# Altium schematic sheet MICRO.SchDoc
size A4; SheetNumber: 1; SheetTotal: 6
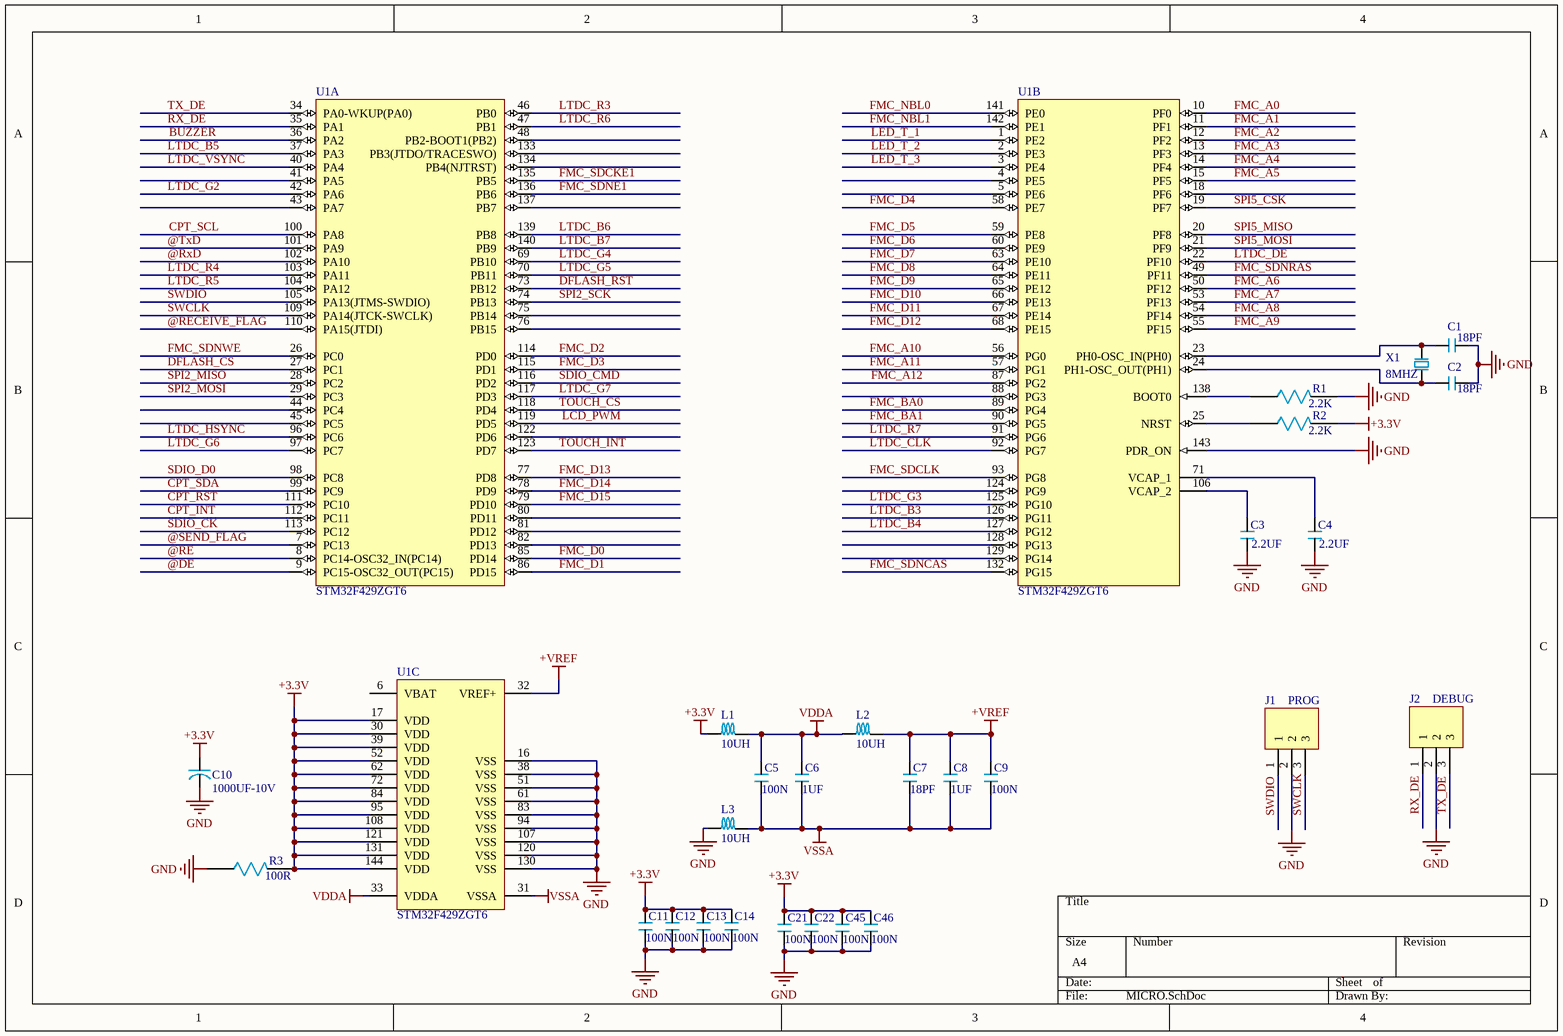
[diagram p0: MICRO.SchDoc]

## Parts
C1  18PF  [0603]
C2  18PF  [0603]
C3  2.2UF  [1206]
C4  2.2UF  [1206]
C5  100N  [0603]
C6  1UF  [0603]
C7  18PF  [0603]
C8  1UF  [0603]
C9  100N  [0603]
C10  1000UF-10V  [RB.2/.4]
C11  100N  [0603]
C12  100N  [0603]
C13  100N  [0603]
C14  100N  [0603]
C21  100N  [0603]
C22  100N  [0603]
C45  100N  [0603]
C46  100N  [0603]
J1  PROG  [SIP3]
J2  DEBUG  [SIP3]
L1  10UH  [1206]
L2  10UH  [1206]
L3  10UH  [1206]
R1  2.2K  [0603]
R2  2.2K  [0603]
R3  100R  [1206]
U1  STM32F429ZGT6  [STM-LQFP144_N]  (parts A,B,C of 3)
X1  8MHZ  [XTAL_1]

## Nets
+3.3V: C10.1 C11.2 C12.2 C13.2 C14.2 C21.2 C22.2 C45.2 C46.2 L1.1 R2.2 R3.2 U1.17(VDD) U1.30(VDD) U1.39(VDD) U1.52(VDD) U1.62(VDD) U1.72(VDD) U1.84(VDD) U1.95(VDD) U1.108(VDD) U1.121(VDD) U1.131(VDD) U1.144(VDD)
+VREF: C7.2 C8.2 C9.2 L2.2 U1.32(VREF+)
GND: C1.2 C2.2 C3.1 C4.1 C10.2 C11.1 C12.1 C13.1 C14.1 C21.1 C22.1 C45.1 C46.1 J1.2 J2.2 L3.1 R1.2 R3.1 U1.16(VSS) U1.38(VSS) U1.51(VSS) U1.61(VSS) U1.83(VSS) U1.94(VSS) U1.107(VSS) U1.120(VSS) U1.130(VSS) U1.143(PDR_ON)
VDDA: C5.2 C6.2 L1.2 L2.1 U1.33(VDDA)
VSSA: C5.1 C6.1 C7.1 C8.1 C9.1 L3.2 U1.31(VSSA)
@DE: U1.9(PC15-OSC32_OUT(PC15))
@RE: U1.8(PC14-OSC32_IN(PC14))
@RECEIVE_FLAG: U1.110(PA15(JTDI))
@RxD: U1.102(PA10)
@SEND_FLAG: U1.7(PC13)
@TxD: U1.101(PA9)
BUZZER: U1.36(PA2)
CPT_INT: U1.112(PC11)
CPT_RST: U1.111(PC10)
CPT_SCL: U1.100(PA8)
CPT_SDA: U1.99(PC9)
DFLASH_CS: U1.27(PC1)
DFLASH_RST: U1.73(PB12)
FMC_A0: U1.10(PF0)
FMC_A1: U1.11(PF1)
FMC_A2: U1.12(PF2)
FMC_A3: U1.13(PF3)
FMC_A4: U1.14(PF4)
FMC_A5: U1.15(PF5)
FMC_A6: U1.50(PF12)
FMC_A7: U1.53(PF13)
FMC_A8: U1.54(PF14)
FMC_A9: U1.55(PF15)
FMC_A10: U1.56(PG0)
FMC_A11: U1.57(PG1)
FMC_A12: U1.87(PG2)
FMC_BA0: U1.89(PG4)
FMC_BA1: U1.90(PG5)
FMC_D0: U1.85(PD14)
FMC_D1: U1.86(PD15)
FMC_D2: U1.114(PD0)
FMC_D3: U1.115(PD1)
FMC_D4: U1.58(PE7)
FMC_D5: U1.59(PE8)
FMC_D6: U1.60(PE9)
FMC_D7: U1.63(PE10)
FMC_D8: U1.64(PE11)
FMC_D9: U1.65(PE12)
FMC_D10: U1.66(PE13)
FMC_D11: U1.67(PE14)
FMC_D12: U1.68(PE15)
FMC_D13: U1.77(PD8)
FMC_D14: U1.78(PD9)
FMC_D15: U1.79(PD10)
FMC_NBL0: U1.141(PE0)
FMC_NBL1: U1.142(PE1)
FMC_SDCKE1: U1.135(PB5)
FMC_SDCLK: U1.93(PG8)
FMC_SDNCAS: U1.132(PG15)
FMC_SDNE1: U1.136(PB6)
FMC_SDNRAS: U1.49(PF11)
FMC_SDNWE: U1.26(PC0)
LCD_PWM: U1.119(PD5)
LED_T_1: U1.1(PE2)
LED_T_2: U1.2(PE3)
LED_T_3: U1.3(PE4)
LTDC_B3: U1.126(PG11)
LTDC_B4: U1.127(PG12)
LTDC_B5: U1.37(PA3)
LTDC_B6: U1.139(PB8)
LTDC_B7: U1.140(PB9)
LTDC_CLK: U1.92(PG7)
LTDC_DE: U1.22(PF10)
LTDC_G2: U1.42(PA6)
LTDC_G3: U1.125(PG10)
LTDC_G4: U1.69(PB10)
LTDC_G5: U1.70(PB11)
LTDC_G6: U1.97(PC7)
LTDC_G7: U1.117(PD3)
LTDC_HSYNC: U1.96(PC6)
LTDC_R3: U1.46(PB0)
LTDC_R4: U1.103(PA11)
LTDC_R5: U1.104(PA12)
LTDC_R6: U1.47(PB1)
LTDC_R7: U1.91(PG6)
LTDC_VSYNC: U1.40(PA4)
RX_DE: J2.1 U1.35(PA1)
SDIO_CK: U1.113(PC12)
SDIO_CMD: U1.116(PD2)
SDIO_D0: U1.98(PC8)
SPI2_MISO: U1.28(PC2)
SPI2_MOSI: U1.29(PC3)
SPI2_SCK: U1.74(PB13)
SPI5_CSK: U1.19(PF7)
SPI5_MISO: U1.20(PF8)
SPI5_MOSI: U1.21(PF9)
SWCLK: J1.3 U1.109(PA14(JTCK-SWCLK))
SWDIO: J1.1 U1.105(PA13(JTMS-SWDIO))
TOUCH_CS: U1.118(PD4)
TOUCH_INT: U1.123(PD7)
TX_DE: J2.3 U1.34(PA0-WKUP(PA0))
NetC1_1: C1.1 U1.23(PH0-OSC_IN(PH0)) X1.2
NetC2_1: C2.1 U1.24(PH1-OSC_OUT(PH1)) X1.1
NetC3_2: C3.2 U1.106(VCAP_2)
NetC4_2: C4.2 U1.71(VCAP_1)
NetR1_1: R1.1 U1.138(BOOT0)
NetR2_1: R2.1 U1.25(NRST)

Not connected (* = marked no-connect by the designer): U1 4(PE5) 5(PE6) 6(VBAT) 18(PF6) 41(PA5) 43(PA7) 44(PC4) 45(PC5) 48(PB2-BOOT1(PB2)) 75(PB14) 76(PB15) 80(PD11) 81(PD12) 82(PD13) 88(PG3) 122(PD6) 124(PG9) 128(PG13) 129(PG14) 133(PB3(JTDO/TRACESWO)) 134(PB4(NJTRST)) 137(PB7)

## Library data of the parts
C1-C9 C11-C14 C21 C22 C45 C46 = CAP
C10 = CAP_POL
J1 J2 = SIP3
L1-L3 = SELF
R1-R3 = RES
U1 = STM32F429ZGT6: ARM Cortex-M4 32-bit MCU+FPU, 225 DMIPS, 1024 kB Flash, 256 kB Internal RAM, 114 I/Os, 144-pin LQFP, -40 to 85 degC, Tray; Manufacturer: STMicroelectronics; D/A Converter: 2x12-bit; FLASH Size (Prog) (kB): 1024; I/Os (High Current): 114; Internal RAM Size (kB): 256; Operating Frequency(F) (Processor speed) (MHz): 180; Supply Voltage(Vcc) max (V): 3.6; Supply Voltage(Vcc) min (V): 1.8; DatasheetVersion: Rev. 2; PackageVersion: Rev. 4, 06/2013; PackageReference: LQFP144; PackageDescription: 144-Pin Low Profile Quad Flat Package, 20 x 20 mm Body, 0.5 mm Pitch; Supplier 1: Digi-Key; Supplier Part Number 1: STM32F429ZGT6-ND; Supplier 2: Newark; Supplier Part Number 2: 06X3675; Supplier 3: Mouser; Supplier Part Number 3: 511-STM32F429ZGT6; Core: ARM Cortex-M4; Packing: Tray; Mounting Technology: Surface Mount; PartNumber: STM32F429ZGT6; ComponentLink1Description: Manufacturer URL; ComponentLink1URL: http://www.st.com/web/en/home.html; ComponentLink2Description: Datasheet; ComponentLink2URL: http://www.st.com/st-web-ui/static/active/en/resource/technical/document/data_brief/DM00053488.pdf; ComponentLink3Description: Package Specification; ComponentLink3URL: http://www.st.com/st-web-ui/static/active/en/resource/technical/document/datasheet/DM00037051.pdf
X1 = XTAL